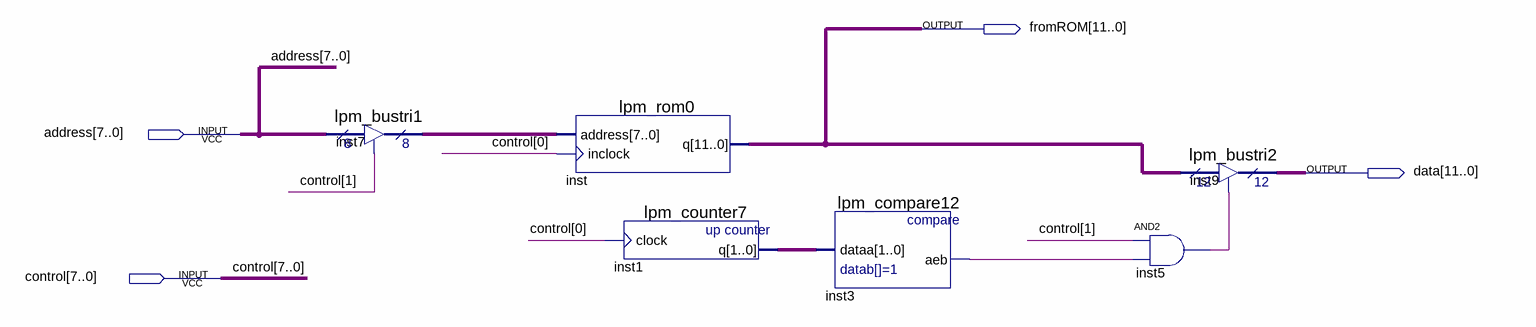
[diagram p0: schematic sheet]
// Quartus schematic MemoryBlock.bdf as structural Verilog: 6 symbols, 4 pins
module MemoryBlock (
  input  [7:0] address,
  input  [7:0] control,
  output [11:0] fromROM,
  output [11:0] data
);

  wire inst3_aeb, inst5_out;
  wire [1:0] inst1_q;
  wire [7:0] inst7_tridata;

  lpm_bustri1 inst7 (.enabledt(control[1]), .data(address), .tridata(inst7_tridata));
  lpm_rom0 inst (.address(inst7_tridata), .inclock(control[0]), .q(fromROM));
  lpm_counter7 inst1 (.clock(control[0]), .q(inst1_q));
  lpm_compare12 inst3 (.dataa(inst1_q), .aeb(inst3_aeb));
  lpm_bustri2 inst9 (.enabledt(inst5_out), .data(fromROM), .tridata(data));
  and inst5 (inst5_out, control[1], inst3_aeb);
endmodule
